# EAGLE design gismoviv1 (EAGLE 7.4.0)
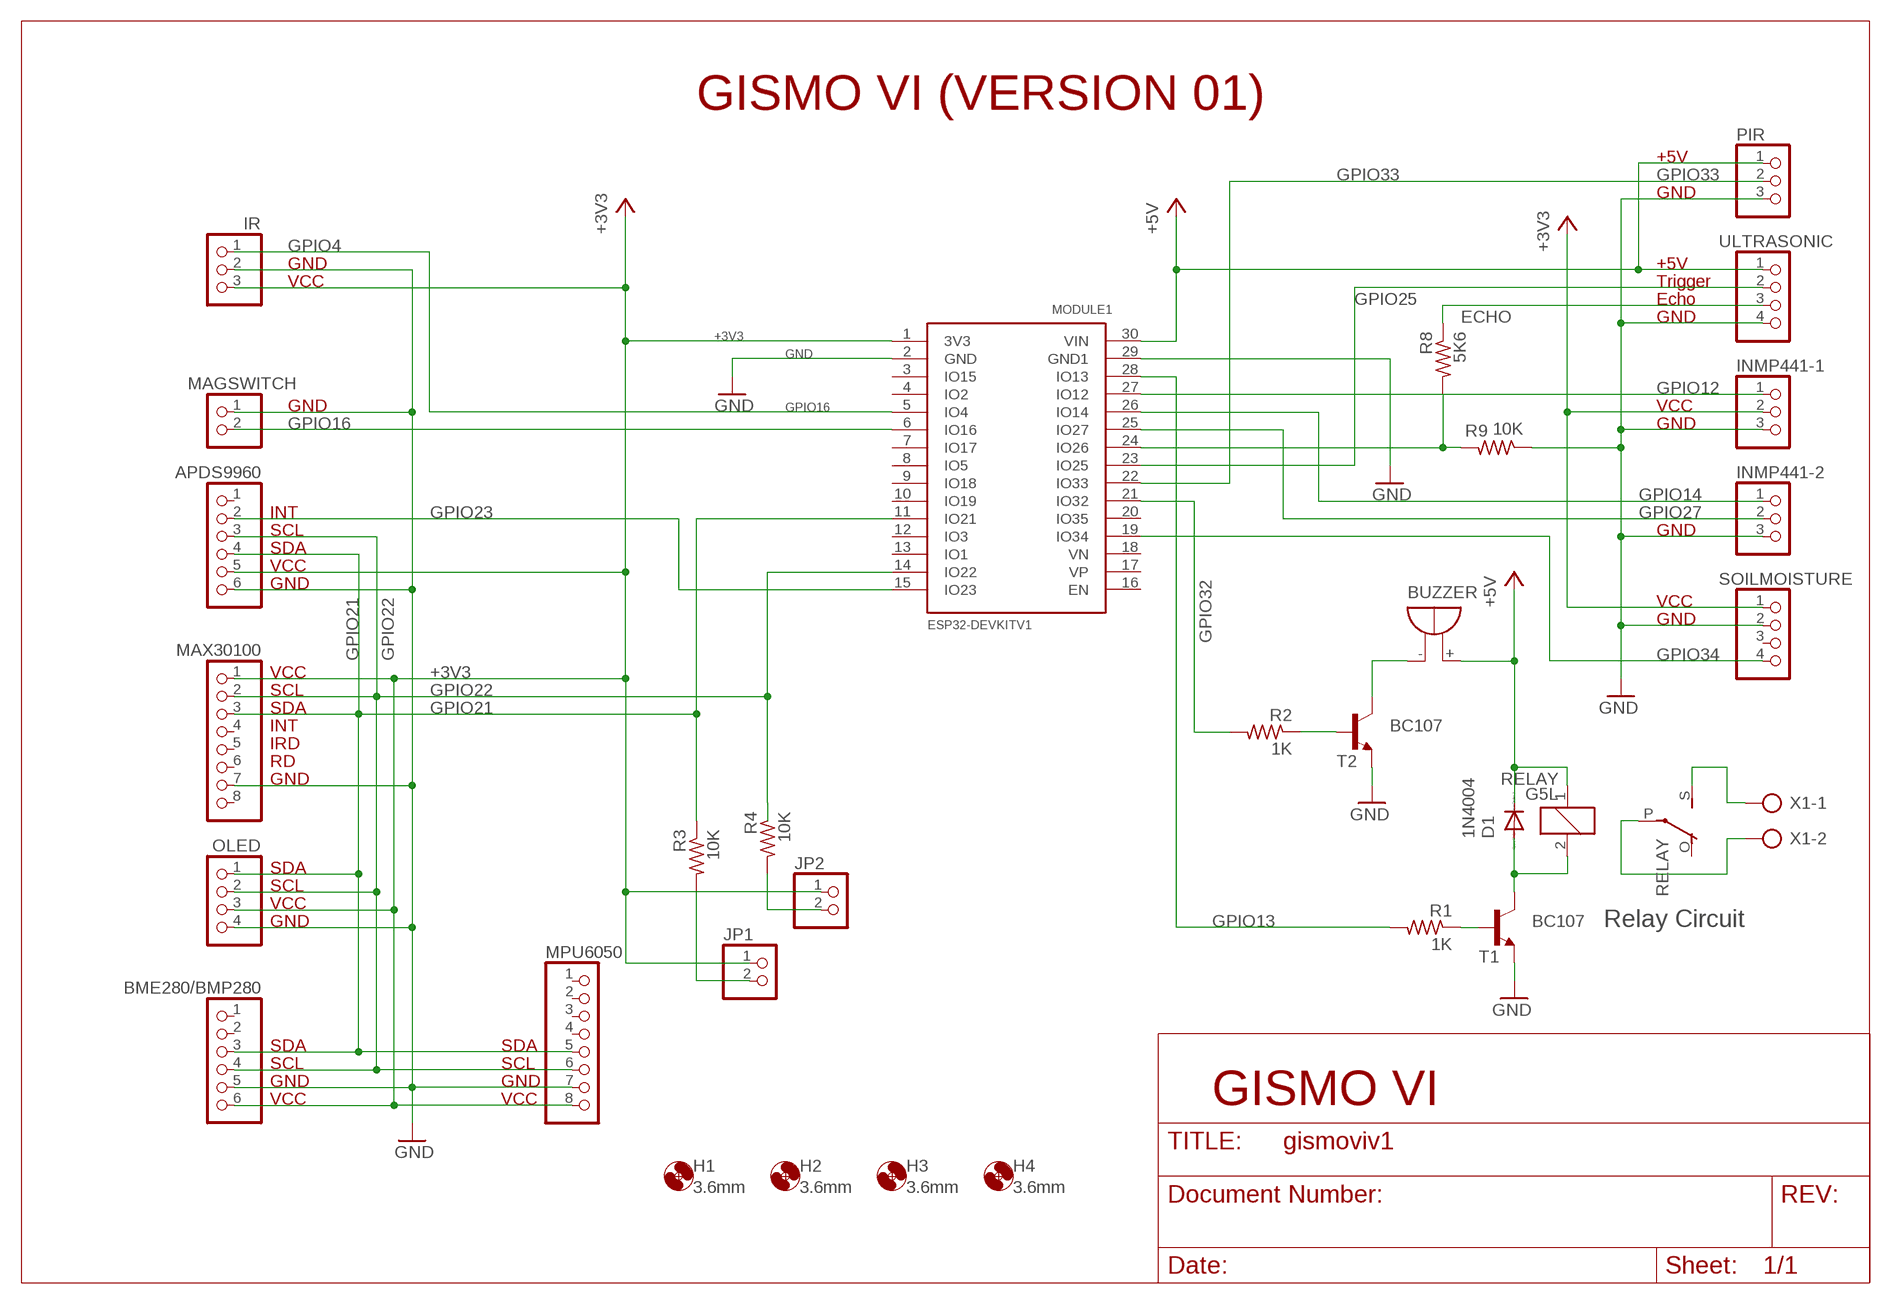
[diagram p0: schematic, sheet 1]

## Parts
APDS9960  PINHD-1X6  [1X06]
BME280/BMP280  PINHD-1X6  [1X06]
BUZZER  F/QMB  [F/QMB]
D1  1N4004  [DO41-10]
H1  3.6mm  MOUNT-HOLE3.6  [3,6]
H2  3.6mm  MOUNT-HOLE3.6  [3,6]
H3  3.6mm  MOUNT-HOLE3.6  [3,6]
H4  3.6mm  MOUNT-HOLE3.6  [3,6]
INMP441-1  PINHD-1X3  [1X03]
INMP441-2  PINHD-1X3  [1X03]
IR  PINHD-1X3  [1X03]
JP1  PINHD-1X2  [1X02]
JP2  PINHD-1X2  [1X02]
MAGSWITCH  PINHD-1X2  [1X02]
MAX30100  PINHD-1X8  [1X08]
MODULE1  ESP32DEVKITV1  [ESP32-DEVKITV1]
MPU6050  PINHD-1X8  [1X08]
OLED  PINHD-1X4  [1X04]
PIR  PINHD-1X3  [1X03]
R1  1K  R-US_0204/7  [0204/7]
R2  1K  R-US_0204/7  [0204/7]
R3  10K  R-US_0204/7  [0204/7]
R4  10K  R-US_0204/7  [0204/7]
R8  5K6  R-US_0204/7  [0204/7]
R9  10K  R-US_0204/7  [0204/7]
RELAY  G5L  [G5LE]
SOILMOISTURE  PINHD-1X4  [1X04]
T1  BC107  BC107A-NPN-TO18-EBC  [TO18]
T2  BC107  BC107A-NPN-TO18-EBC  [TO18]
ULTRASONIC  PINHD-1X4  [1X04]
X1  AK500/2  [AK500/2]

## Nets
+3V3: APDS9960.5 BME280/BMP280.6 INMP441-1.2 IR.3 JP1.1 JP2.1 MAX30100.1 MODULE1.1(3V3) MPU6050.8 OLED.3 SOILMOISTURE.1
+5V: BUZZER.+(-) D1.C MODULE1.30(VIN) PIR.1 RELAY.1 ULTRASONIC.1
BUZZERCONTROL: R2.1 T2.2(B)
BUZZERGROUND: BUZZER.-(+) T2.3(C)
ECHO: R8.1 ULTRASONIC.3
GND: APDS9960.6 BME280/BMP280.5 INMP441-1.3 INMP441-2.3 IR.2 MAGSWITCH.1 MAX30100.7 MODULE1.2(GND) MODULE1.29(GND1) MPU6050.7 OLED.4 PIR.3 R9.1 SOILMOISTURE.2 T1.1(E) T2.1(E) ULTRASONIC.4
GPIO4: IR.1 MODULE1.5(IO4)
GPIO12: INMP441-1.1 MODULE1.27(IO12)
GPIO13: MODULE1.28(IO13) R1.2
GPIO14: INMP441-2.1 MODULE1.26(IO14)
GPIO16: MAGSWITCH.2 MODULE1.6(IO16)
GPIO21: APDS9960.4 BME280/BMP280.3 MAX30100.3 MODULE1.11(IO21) MPU6050.5 OLED.1 R3.1
GPIO22: APDS9960.3 BME280/BMP280.4 MAX30100.2 MODULE1.14(IO22) MPU6050.6 OLED.2 R4.1
GPIO23: APDS9960.2 MODULE1.15(IO23)
GPIO25: MODULE1.23(IO25) ULTRASONIC.2
GPIO26: MODULE1.24(IO26) R8.2 R9.2
GPIO27: INMP441-2.2 MODULE1.25(IO27)
GPIO32: MODULE1.21(IO32) R2.2
GPIO33: MODULE1.22(IO33) PIR.2
GPIO34: MODULE1.19(IO34) SOILMOISTURE.4
N$1: JP1.2 R3.2
N$2: JP2.2 R4.2
N$8: D1.A RELAY.2 T1.3(C)
N$9: RELAY.P(2:P) X1.2
N$10: RELAY.S(2:S) X1.1
N$11: R1.1 T1.2(B)
Unconnected: APDS9960.1 BME280/BMP280.1 BME280/BMP280.2 MAX30100.4 MAX30100.5 MAX30100.6 MAX30100.8 MODULE1.3(IO15) MODULE1.4(IO2) MODULE1.7(IO17) MODULE1.8(IO5) MODULE1.9(IO18) MODULE1.10(IO19) MODULE1.12(IO3) MODULE1.13(IO1) MODULE1.16(EN) MODULE1.17(VP) MODULE1.18(VN) MODULE1.20(IO35) MPU6050.1 MPU6050.2 MPU6050.3 MPU6050.4 RELAY.O(2:O) SOILMOISTURE.3

## Notes on the sheet
- GISMO VI (VERSION 01)
- +5V
- GND
- GND | +5V
- VCC | Trigger
- Echo
- GND
- GND | VCC
- GND
- INT
- SCL | GND
- SDA
- VCC
- GND
- VCC
- GND
- VCC
- SCL
- SDA
- INT
- IRD
- RD
- GND
- SDA
- SCL
- VCC
- GND | Relay Circuit
- SDA | SDA
- SCL | SCL
- GND | GND
- VCC | VCC | GISMO VI

## Library data of the parts
APDS9960 BME280/BMP280 = pinhead01:PINHD-1X6: PIN HEADER
BUZZER = buzzer:F/QMB: BUZZER Source: Buerklin; OC_FARNELL: unknown; OC_NEWARK: unknown
D1 = diode:1N4004: DIODE general purpose rectifier, 1 A
H1-H4 = holes:MOUNT-HOLE: MOUNTING HOLE with drill center marker
INMP441-1 INMP441-2 IR PIR = pinhead01:PINHD-1X3: PIN HEADER
JP1 JP2 MAGSWITCH = pinhead01:PINHD-1X2: PIN HEADER
MAX30100 MPU6050 = pinhead01:PINHD-1X8: PIN HEADER
MODULE1 = ESP32-DEVKITV1:ESP32DEVKITV1
OLED SOILMOISTURE ULTRASONIC = pinhead01:PINHD-1X4: PIN HEADER
R1-R4 R8 R9 = rcl:R-US_: RESISTOR, American symbol
RELAY = relay:G5L: RELAY 1 x switch, 10 A/120 V AC, 8 A/30 V ADC, Omron; OC_FARNELL: unknown; OC_NEWARK: unknown
T1 T2 = transistor:*-NPN-: NPN Transistror BF959 corrected 2008.03.06
X1 = con-ptr500:AK500/2: CONNECTOR; OC_FARNELL: unknown; OC_NEWARK: unknown

## Board
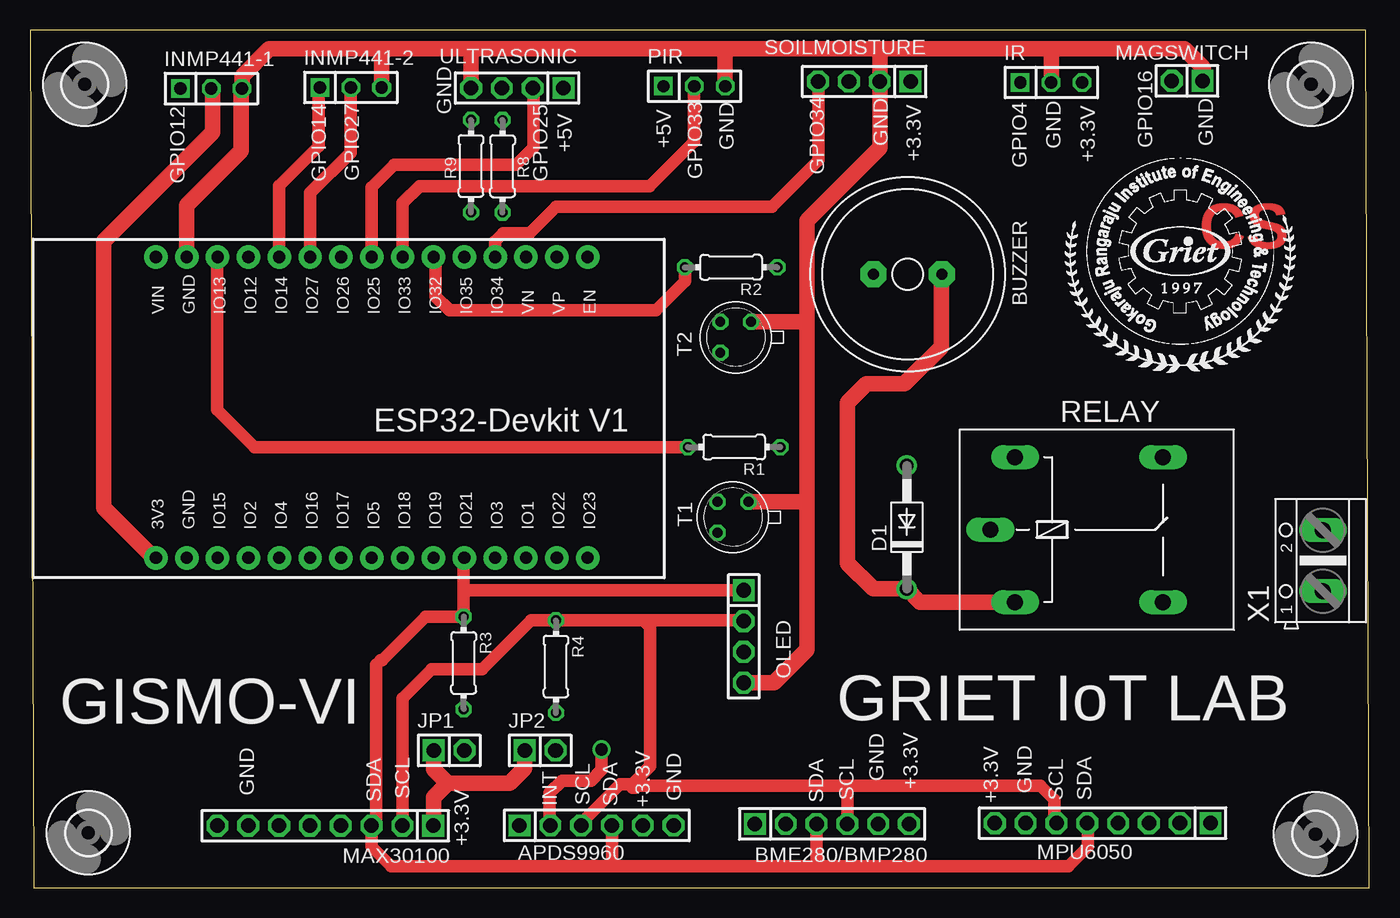
[diagram p1: board, top side]
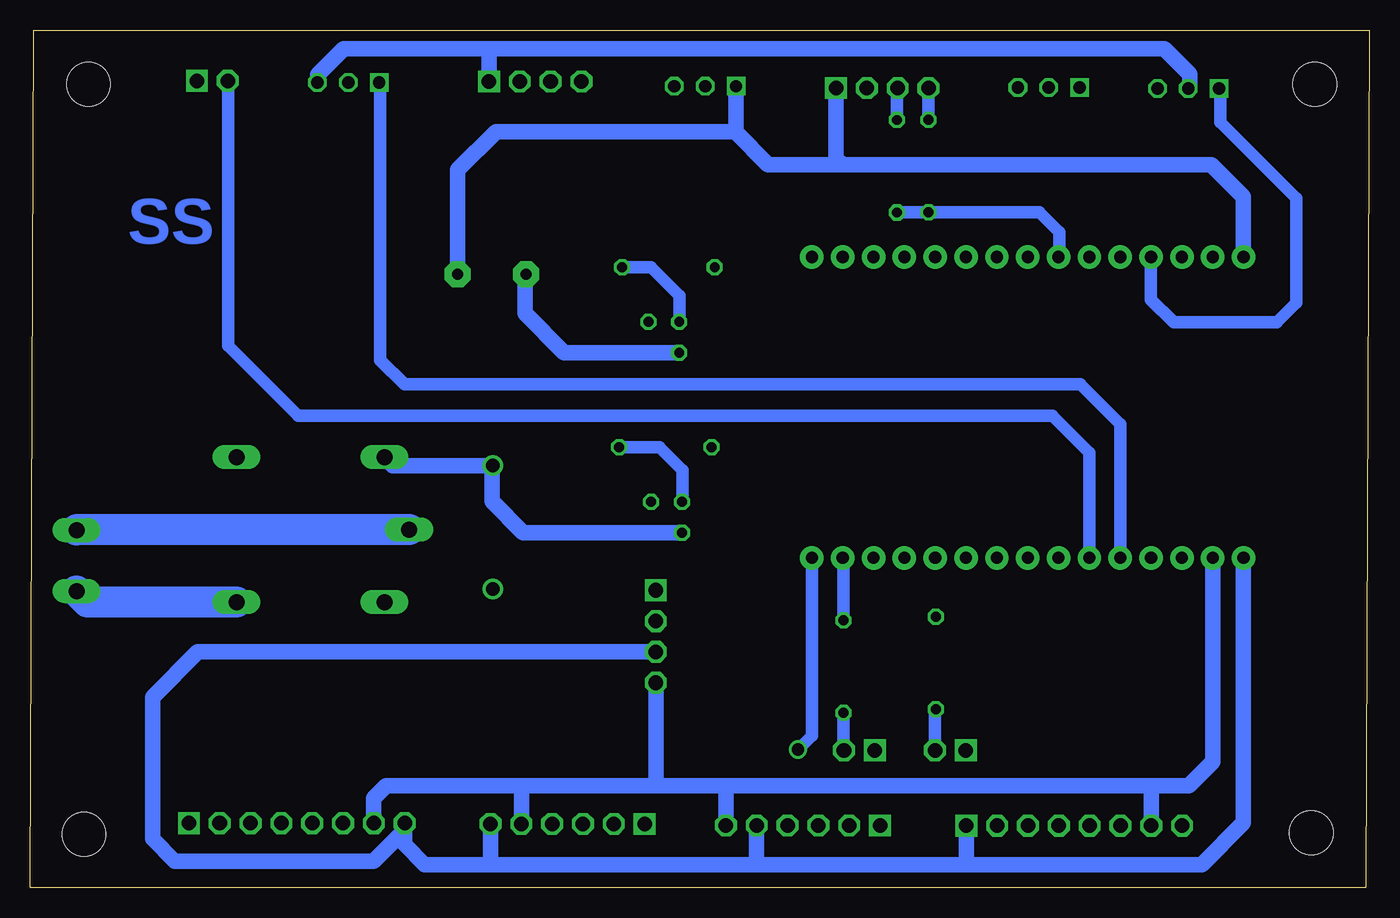
[diagram p2: board, bottom side, seen from below]

Size 110.3 x 70.6 mm. Coordinates in mm from the lower left corner, seen from the top.
Outline: 0.3,0 110.3,0 110,70.6 0,70.6 0.3,0
Copper layers (1*16): Top 0.035mm / dielectric 1.5mm / Bottom 0.035mm
Design rules "default *": minimum track width 10mil, minimum drill 24mil, track to track 8mil, track to pad 8mil, pad to pad 8mil, via to via 8mil, smd to smd 8mil, copper to edge 30mil, drill to drill 8mil, minimum pad ring 10mil, minimum via ring 8mil, stop-mask expansion 4mil, vias tented up to drill 0mil, thermal gap 10mil

### Footprints (pad centres in the part's own frame; a part is rotated, then mirrored left to right if it is on the bottom)
1X06 = drill 1.2 square: 1 -6.35,0 | drill 1.2 octagon: 2 -3.81,0; 3 -1.27,0; 4 1.27,0; 5 3.81,0; 6 6.35,0
F/QMB = drill 0.914 pad 2.159 octagon: + 2.81,0; - -2.81,0
DO41-10 = drill 1.118: A 5.08,0; C -5.08,0
3,6 = hole 3.6: 0,0
1X03 = drill 1.016 square: 1 -2.54,0 | drill 1.016 octagon: 2 0,0; 3 2.54,0
1X02 = drill 1.2 square: 1 -1.27,0 | drill 1.2 octagon: 2 1.27,0
1X08 = drill 1.2 square: 1 -8.89,0 | drill 1.2 octagon: 2 -6.35,0; 3 -3.81,0; 4 -1.27,0; 5 1.27,0; 6 3.81,0; 7 6.35,0; 8 8.89,0
ESP32-DEVKITV1 = drill 1 pad 1.93: 1 -22.87,-13.54; 2 -20.33,-13.54; 3 -17.79,-13.54; 4 -15.25,-13.54; 5 -12.71,-13.54; 6 -10.17,-13.54; 7 -7.63,-13.54; 8 -5.09,-13.54; 9 -2.55,-13.54; 10 -0.01,-13.54; 11 2.53,-13.54; 12 5.07,-13.54; 13 7.61,-13.54; 14 10.15,-13.54; 15 12.69,-13.54; 16 12.69,11.23; 17 10.15,11.23; 18 7.61,11.23; 19 5.07,11.23; 20 2.53,11.23; 21 -0.01,11.23; 22 -2.55,11.23; 23 -5.09,11.23; 24 -7.63,11.23; 25 -10.17,11.23; 26 -12.71,11.23; 27 -15.25,11.23; 28 -17.79,11.23; 29 -20.33,11.23; 30 -22.87,11.23
1X04 = drill 1.2 square: 1 -3.81,0 | drill 1.2 octagon: 2 -1.27,0; 3 1.27,0; 4 3.81,0
0204/7 = drill 0.813 octagon: 1 -3.81,0; 2 3.81,0
G5LE = drill 1.321 long: 1 -7.493,-5.969; 2 -7.493,5.969; O 4.699,5.969; P -9.525,0; S 4.699,-5.969
TO18 = drill 0.813 octagon: 1 -1.27,-1.27; 2 1.27,-1.27; 3 1.27,1.27
AK500/2 = drill 1.321 long: 1 -2.515,0; 2 2.515,0

### Placement (x,y rotation side)
APDS9960  46.65,5.12 0 top
BME280/BMP280  66.04,5.24 0 top
BUZZER  72.28,50.51 0 top
D1  72.21,29.68 90 top
H1  4.78,4.51 0 top
H2  105.51,66.15 0 top
H3  4.48,66.15 0 top
H4  105.88,4.41 0 top
INMP441-1  14.9,65.8 0 top
INMP441-2  26.4,65.9 0 top
IR  84.1,66.3 0 top
JP1  34.5,11.3 0 top
JP2  42,11.3 0 top
MAGSWITCH  95.3,66.44 180 top
MAX30100  24.3,5.1 180 top
MODULE1  33.22,40.7 0 top
MPU6050  88.35,5.31 180 top
OLED  58.77,20.68 270 top
PIR  54.7,66 0 top
R1  57.98,36.28 180 top
R2  57.73,51.09 180 top
R3  35.7,18.5 270 top
R4  43.3,18.2 270 top
R8  38.9,59.41 270 top
R9  36.3,59.42 270 top
RELAY  88.62,29.48 0 top
SOILMOISTURE  68.71,66.39 180 top
T1  57.88,30.5 180 top
T2  58.11,45.32 180 top
U$1  [LOGOSMALL]  85.23,42.42 0 top
ULTRASONIC  40.11,65.85 180 top
X1  106.49,26.93 90 top

### Tracks (layer width: path | path; a pad name or v marks a point on that pad's centre or on a via)
+3V3
  Top 1.27: JP2.1 40.73,9.84 39.49,8.6 34.39,8.6 | 34.39,8.6 33.22,7.43 33.22,5.13 MAX30100.1 | JP1.1 33.23,9.76 34.39,8.6 | MODULE1.1 10.18,27.16 6.04,31.3 6.04,53.23 15.01,62.2 15.01,65.69 INMP441-1.2
  Bottom 1.27: MODULE1.1 10.35,5.33 13.78,1.9 33.08,1.9 | 33.08,1.9 50.49,1.9 | 50.49,1.9 72.49,1.9 | 72.49,1.9 77.81,1.9 79.48,3.57 79.48,4.74 | 79.48,4.74 79.48,5.29 MPU6050.8 | MAX30100.1 33.19,2.01 33.08,1.9 | APDS9960.5 50.46,1.93 50.49,1.9 | BME280/BMP280.6 72.39,2 72.49,1.9 | OLED.3 96.5,19.41 100.24,15.67 100.24,4.01 98.42,2.19 82.03,2.19 79.48,4.74 | 14.93,65.77 INMP441-1.2 14.76,65.94 14.76,66.98 16.86,69.08 72.7,69.08 | IR.3 86.64,66.94 84.5,69.08 72.7,69.08 | SOILMOISTURE.1 72.52,68.9 72.7,69.08
+5V
  Top 1.27: BUZZER.+ 75.04,50.46 75.04,44.51 72.03,41.5 68.9,41.5 67.33,39.93 67.33,26.71 69.44,24.6 D1.C 73.3,23.51 RELAY.1
  Bottom 1.27: MODULE1.30 10.35,56.89 12.99,59.53 43.37,59.53 | 43.37,59.53 49.51,59.53 52.18,62.2 | 52.18,62.2 52.18,65.98 PIR.1 | ULTRASONIC.1 43.92,60.08 43.37,59.53 | BUZZER.+ 75.09,59.11 71.95,62.25 52.23,62.25 52.18,62.2
BUZZERCONTROL
  Bottom 1.016: R2.1 59.17,51.09 56.82,48.74 56.82,46.61 T2.2
BUZZERGROUND
  Bottom 1.27: T2.3 66.31,44.05 69.56,47.3 69.56,50.42 BUZZER.-
ECHO
  Bottom 1.016: R8.1 38.9,65.79 ULTRASONIC.3
GND
  Top 1.27: 29.39,69.08 19.69,69.08 17.44,66.83 INMP441-1.3 17.35,65.71 17.35,60.67 12.89,56.21 MODULE1.29 | 29.39,69.08 36.26,69.08 | 36.26,69.08 57.11,69.08 | 57.11,69.08 69.79,69.08 | 69.79,69.08 84.02,69.08 | 84.02,69.08 95.08,69.08 96.62,67.54 96.62,66.49 MAGSWITCH.1 | INMP441-2.3 28.94,68.63 29.39,69.08 | ULTRASONIC.4 36.3,69.04 36.26,69.08 | PIR.3 57.24,68.95 57.11,69.08 | 69.79,69.08 69.98,68.89 SOILMOISTURE.2 69.98,60.95 63.97,54.94 63.97,46.58 | IR.2 84.1,69 84.02,69.08 | OLED.4 61.25,16.87 63.97,19.59 63.97,31.8 | 63.97,31.8 63.97,46.58 | T2.1 63.96,46.59 63.97,46.58 | T1.1 63.94,31.77 63.97,31.8
  Bottom 1.016: R9.1 ULTRASONIC.4
  Bottom 1.27: MODULE1.2 12.89,10.36 14.87,8.38 17.64,8.38 | 17.64,8.38 52.82,8.38 | 52.82,8.38 58.86,8.38 | 58.86,8.38 70.15,8.38 | 70.15,8.38 81.01,8.38 82.03,7.36 82.03,5.34 MPU6050.7 | MAX30100.7 17.95,8.07 17.64,8.38 | APDS9960.6 53,8.2 52.82,8.38 | BME280/BMP280.5 69.85,8.08 70.15,8.38 | OLED.4 58.77,8.47 58.86,8.38
GPIO4
  Bottom 1.016: MODULE1.5 20.51,38.16 23.79,41.44 79.47,41.44 81.47,43.44 81.47,66.21 IR.1
GPIO12
  Bottom 1.016: MODULE1.27 17.97,48.43 16.11,46.57 7.62,46.57 6.01,48.18 6.01,56.77 12.28,63.04 12.28,65.72 INMP441-1.1
GPIO13
  Top 1.016: R1.2 18.47,36.28 15.38,39.37 15.38,51.88 MODULE1.28
GPIO14
  Top 1.016: MODULE1.26 20.51,57.81 23.77,61.07 23.77,65.81 INMP441-2.1
GPIO16
  Bottom 1.016: MODULE1.6 23.05,35.82 26.11,38.88 88.25,38.88 94.01,44.64 94.01,66.42 MAGSWITCH.2
GPIO21
  Top 1.016: 35.7,24.49 R3.1 32.58,22.31 29,18.73 28.85,18.73 28.49,18.37 28.49,5.48 MAX30100.3 28.11,3.37 29.73,1.75 47.79,1.75 | 35.7,24.49 35.7,27.11 MODULE1.11 | 47.79,1.75 64.84,1.75 | 64.84,1.75 85.53,1.75 87.13,3.35 87.13,5.26 MPU6050.5 | APDS9960.4 47.92,1.88 47.79,1.75 | BME280/BMP280.3 64.77,1.82 64.84,1.75 | OLED.1 35.7,24.49
GPIO22
  Top 1.016: MAX30100.2 30.67,5.12 30.67,15.6 33.07,18 37.23,18 41.24,22.01 R4.1 50.49,22.01 | 50.49,22.01 58.71,22.01 OLED.2 | 67.02,8.38 49.98,8.38 49.84,8.24 49.61,8.24 49.61,8.39 49.47,8.53 | 67.02,8.38 83.2,8.38 84.36,7.22 84.36,5.49 MPU6050.6 | BME280/BMP280.4 67.31,8.09 67.02,8.38 | APDS9960.3 45.38,5.32 48.59,8.53 49.47,8.53 | 49.47,8.53 49.61,8.53 51.07,9.99 51.07,21.43 50.49,22.01
  Bottom 1.016: R4.1 43.3,27.09 MODULE1.14
GPIO23  (via drill 1)
  Top 1.016: v47.06,11.37 47.06,9.69 46.19,8.82 43.79,8.82 42.77,7.8 42.77,5.19 APDS9960.2
  Bottom 1.016: MODULE1.15 45.91,12.52 v47.06,11.37
GPIO25
  Top 1.016: MODULE1.23 28.13,57.68 29.98,59.53 40,59.53 41.44,60.97 41.44,65.79 ULTRASONIC.2
GPIO26
  Bottom 1.016: R8.2 R9.2 27.17,55.61 25.52,53.96 25.52,52 MODULE1.24
GPIO27
  Top 1.016: MODULE1.25 23.05,57.22 26.37,60.54 26.37,65.87 INMP441-2.2
GPIO32
  Top 1.016: R2.2 53.92,49.92 51.54,47.54 34.54,47.54 33.4,48.68 33.4,51.74 MODULE1.21
GPIO33
  Top 1.016: MODULE1.22 30.67,56.4 32.05,57.78 51,57.78 54.66,61.44 54.66,65.96 PIR.2
GPIO34
  Top 1.016: MODULE1.19 38.29,53.24 38.95,53.9 41.12,53.9 43.3,56.08 61.09,56.08 64.91,59.9 SOILMOISTURE.4
N$1
  Bottom 1.016: JP1.2 35.77,14.62 R3.2
N$2
  Bottom 1.016: JP2.2 43.3,11.33 R4.2
N$8
  Bottom 1.27: T1.3 69.69,29.23 72.26,31.8 72.26,34.71 D1.A 80.44,34.76 RELAY.2
N$9
  Bottom 2.54: RELAY.P 106.45,29.48 X1.2
N$10
  Bottom 2.54: RELAY.S 105.59,23.51 X1.1
N$11
  Bottom 1.016: R1.1 58.48,36.28 56.58,34.38 56.58,31.8 T1.2

### Text on the board
Top: CS
Bottom: SS
tPlace: GND | +5V | +5V | GND | GND | GND | GPIO16 | GND | +3.3V | +3.3V | GPIO34 | GPIO4 | GPIO12 | GPIO14 | GPIO27 | GPIO25 | GPIO33 | GRIET IoT LAB | GISMO-VI | GND | GND | +3.3V | GND | SDA | SCL | INT | SCL | SDA | +3.3V | GND | SDA | SCL | +3.3V | SCL | SDA | +3.3V